# Altium schematic sheet 8500_ADC_X.SchDoc
size A4
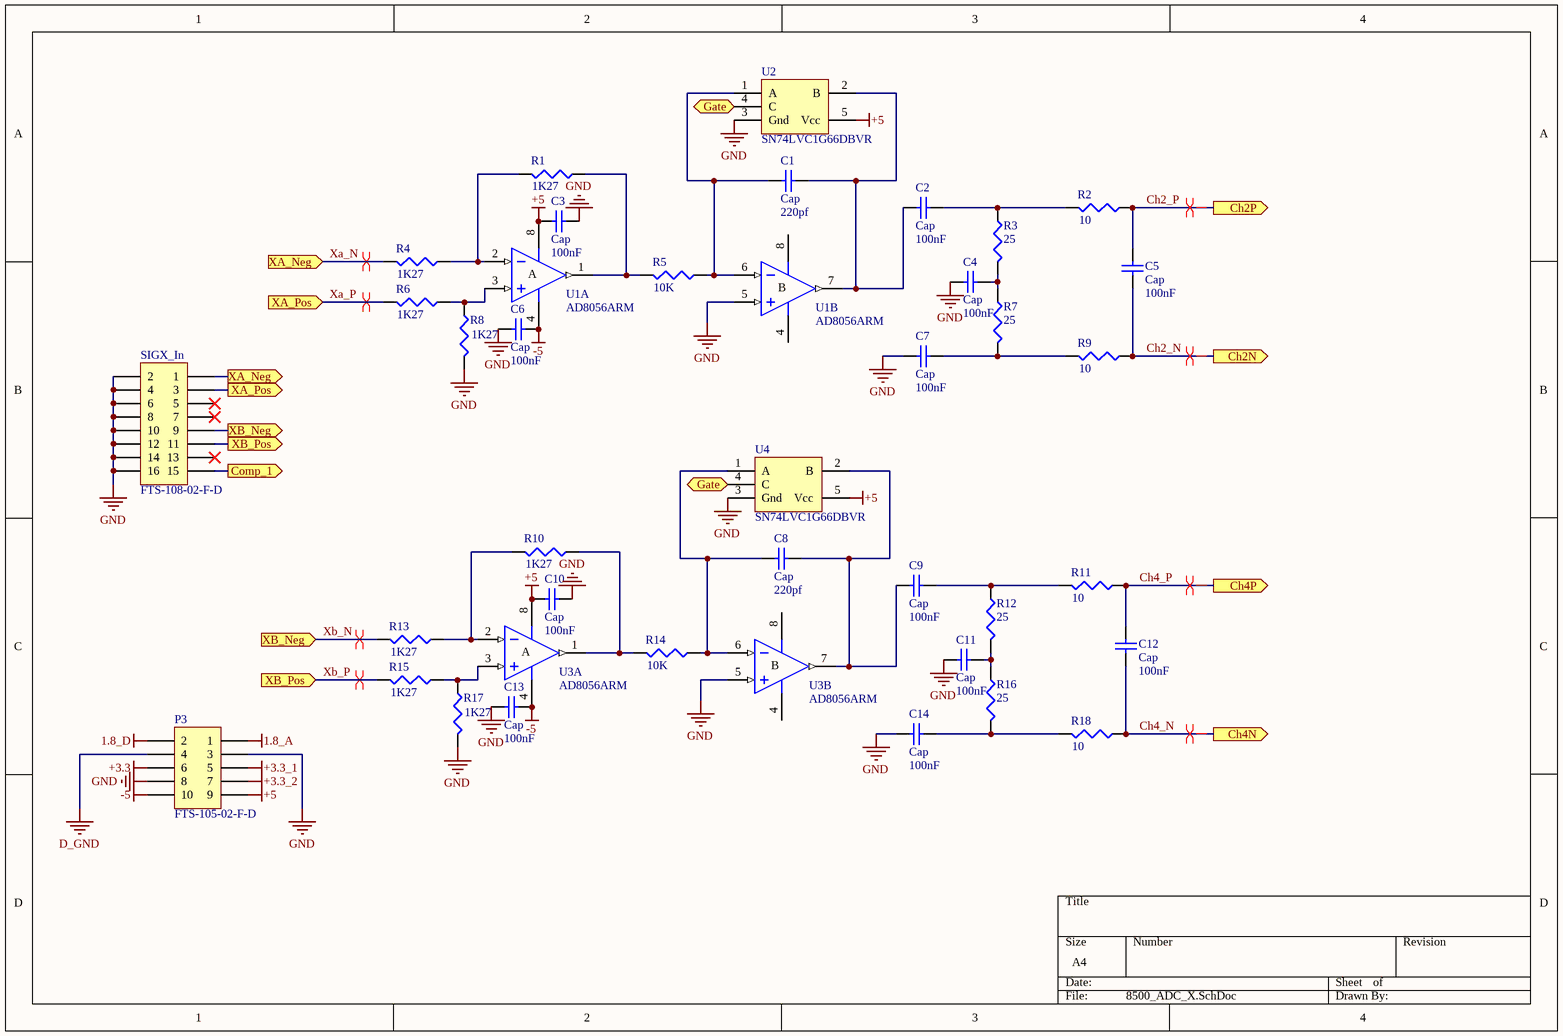
[diagram p0: 8500_ADC_X.SchDoc]

## Parts
C1  Cap  value 220pf  [0402]
C2  Cap  value 100nF  [0402]
C3  Cap  value 100nF  [0402]
C4  Cap  value 100nF  [0402]
C5  Cap  value 100nF  [0402]
C6  Cap  value 100nF  [0402]
C7  Cap  value 100nF  [0402]
C8  Cap  value 220pf  [0402]
C9  Cap  value 100nF  [0402]
C10  Cap  value 100nF  [0402]
C11  Cap  value 100nF  [0402]
C12  Cap  value 100nF  [0402]
C13  Cap  value 100nF  [0402]
C14  Cap  value 100nF  [0402]
P3  FTS-105-02-F-D  [MHDR2X5]
R1  value 1K27  [0402]  (hidden comment: Res3)
R2  value 10  [0402]  (hidden comment: Res3)
R3  value 25  [0402]  (hidden comment: Res3)
R4  value 1K27  [0402]  (hidden comment: Res3)
R5  value 10K  [0402]  (hidden comment: Res3)
R6  value 1K27  [0402]  (hidden comment: Res3)
R7  value 25  [0402]  (hidden comment: Res3)
R8  value 1K27  [0402]  (hidden comment: Res3)
R9  value 10  [0402]  (hidden comment: Res3)
R10  value 1K27  [0402]  (hidden comment: Res3)
R11  value 10  [0402]  (hidden comment: Res3)
R12  value 25  [0402]  (hidden comment: Res3)
R13  value 1K27  [0402]  (hidden comment: Res3)
R14  value 10K  [0402]  (hidden comment: Res3)
R15  value 1K27  [0402]  (hidden comment: Res3)
R16  value 25  [0402]  (hidden comment: Res3)
R17  value 1K27  [0402]  (hidden comment: Res3)
R18  value 10  [0402]  (hidden comment: Res3)
SIGX_In  FTS-108-02-F-D  [MHDR2X8]
U1  AD8056ARM  [RM-8]  (parts A,B of 2)
U2  SN74LVC1G66DBVR  [SOT23-5]
U3  AD8056ARM  [RM-8]  (parts A,B of 2)
U4  SN74LVC1G66DBVR  [SOT23-5]

## Ports
Ch2N (out), Ch2P (out), Ch4N (out), Ch4P (out), Comp_1 (out), Gate (out), XA_Neg (in), XA_Neg (out), XA_Pos (in), XA_Pos (out), XB_Neg (in), XB_Neg (out), XB_Pos (in), XB_Pos (out)

## Nets
1.8_A: P3.1
1.8_D: P3.2
+3.3: P3.6
+3.3_1: P3.5
+3.3_2: P3.7
+5: C3.1 C10.1 P3.9 U1.8(V+) U2.5(Vcc) U3.8(V+) U4.5(Vcc)
-5: C6.2 C13.2 P3.10 U1.4(V-) U3.4(V-)
D_GND: P3.4
GND: C3.2 C4.1 C6.1 C7.1 C10.2 C11.1 C13.1 C14.1 P3.3 P3.8 R8.2 R17.2 SIGX_In.2 SIGX_In.4 SIGX_In.6 SIGX_In.8 SIGX_In.10 SIGX_In.12 SIGX_In.14 SIGX_In.16 U1.5(IN+) U2.3(Gnd) U3.5(IN+) U4.3(Gnd)
Ch2_N: C5.1 R9.1 ; port Ch2N
Ch2_P: C5.2 R2.1 ; port Ch2P
Ch4_N: C12.1 R18.1 ; port Ch4N
Ch4_P: C12.2 R11.1 ; port Ch4P
Comp_1: SIGX_In.15 ; port Comp_1
Gate: U2.4(C) U4.4(C) ; port Gate
Xa_N: R4.2 SIGX_In.1 ; port XA_Neg
Xa_P: R6.2 SIGX_In.3 ; port XA_Pos
Xb_N: R13.2 SIGX_In.9 ; port XB_Neg
Xb_P: R15.2 SIGX_In.11 ; port XB_Pos
NetC1_1: C1.1 R5.1 U1.6(IN-) U2.1(A)
NetC1_2: C1.2 C2.1 U1.7(OUT) U2.2(B)
NetC2_2: C2.2 R2.2 R3.1
NetC4_2: C4.2 R3.2 R7.1
NetC7_2: C7.2 R7.2 R9.2
NetC8_1: C8.1 R14.1 U3.6(IN-) U4.1(A)
NetC8_2: C8.2 C9.1 U3.7(OUT) U4.2(B)
NetC9_2: C9.2 R11.2 R12.1
NetC11_2: C11.2 R12.2 R16.1
NetC14_2: C14.2 R16.2 R18.2
NetR1_1: R1.1 R5.2 U1.1(OUT)
NetR1_2: R1.2 R4.1 U1.2(IN-)
NetR6_1: R6.1 R8.1 U1.3(IN+)
NetR10_1: R10.1 R14.2 U3.1(OUT)
NetR10_2: R10.2 R13.1 U3.2(IN-)
NetR15_1: R15.1 R17.1 U3.3(IN+)

Not connected (* = marked no-connect by the designer): SIGX_In 5* 7* 13*

## Layout directives
differential pair: Ch2_N, Ch2_P, Ch4_N, Ch4_P, Xa_N, Xa_P, Xb_N, Xb_P

## Notes on the sheet
- (in symbol AD8056ARM, part A) A
- (in symbol AD8056ARM, part B) B

## Library data of the parts
C1-C14 = Cap: Capacitor; Published: 8-Jun-2000; LatestRevisionDate: 17-Jul-2002; LatestRevisionNote: Re-released for DXP Platform.; PackageReference: RAD-0.3; Publisher: Altium Limited; PackageDescription: Radial Cap, Thru-Hole; 2 Leads; 0.3 in Pin Spacing
P3 = FTR-105-01-D
R1-R18 = Res3: Resistor; Published: 8-Jun-2000; LatestRevisionDate: 29-May-2009; LatestRevisionNote: IPC-7351 Footprint Added.; PackageReference: J1-0603; Publisher: Altium Limited; PackageDescription: Chip Resistor
SIGX_In = FTR-108-01-D
U1 U3 = AD8056ARM: Low Cost, 300MHz Voltage Feedback Amplifier; Published: 8-Jun-2000; LatestRevisionDate: 04-Mar-2005; LatestRevisionNote: Stylized 3D Model Added, PCB footprint pad width decreased.; DatasheetVersion: REV. 0 1997; PackageVersion: 2004; PackageReference: RM-8; Publisher: Altium Limited; PackageDescription: Shrink Small Outline, MSOP; 8 Leads; Body Width 3 mm; Pitch 0.65 mm; Code_JEDEC: MO-187-AA; ComponentLink1Description: Manufacturer Link; ComponentLink1URL: http://www.analog.com/en/prod/0,,759_786_AD8055%2C00.html; ComponentLink2Description: Datasheet; ComponentLink2URL: http://www.analog.com/UploadedFiles/Data_Sheets/40402558757264AD8055_6_i.pdf